# Altium schematic sheet Sheet1.SchDoc
size A4; SheetNumber: 1; SheetTotal: 1
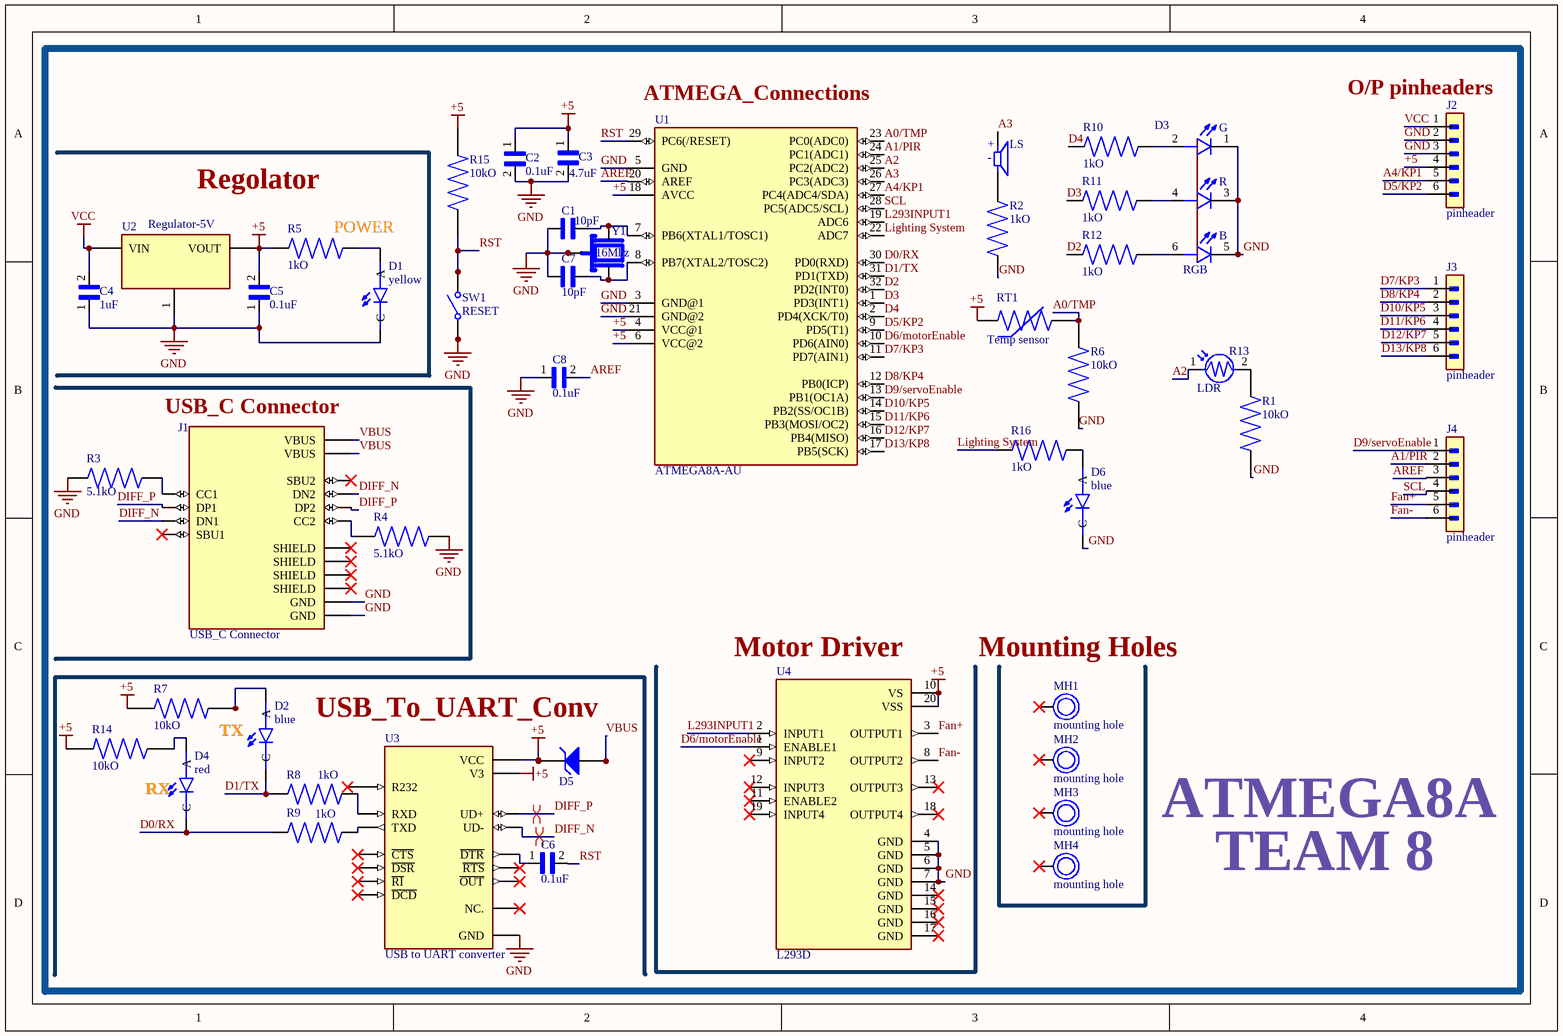
[diagram p0: Sheet1.SchDoc]

## Parts
C1  10pF  [Cap10pF]
C2  0.1uF  [Cap0.1uF]
C3  4.7uF  [Cap4.7uF]
C4  1uF  [Cap 1uF]
C5  0.1uF  [Cap0.1uF]
C6  0.1uF  [Cap0.1uF]
C7  10pF  [Cap10pF]
C8  0.1uF  [Cap0.1uF]
D1  yellow  [yellow LED]
D2  blue  [red LED]
D3  RGB  [RGB LED]
D4  red  [red LED]
D5  Zener  [Zener 5.6V]  (value not drawn)
D6  blue  [red LED]
J1  USB_C Connector  [TYPE-C-31-M-12]
J2  pinheader  [pinheader 6 pins]
J3  pinheader  [pinheader 6 pins]
J4  pinheader  [pinheader 6 pins]
LS  Buzzer  [Buzzers]  (value not drawn)
MH1  mounting hole  [Mounting Hole]  (no BOM)
MH2  mounting hole  [Mounting Hole]  (no BOM)
MH3  mounting hole  [Mounting Hole]  (no BOM)
MH4  mounting hole  [Mounting Hole]  (no BOM)
R1  10kO  [Res10k]
R2  1kO  [Res1k]
R3  5.1kO  [Res5.1kO]
R4  5.1kO  [Res5.1kO]
R5  1kO  [Res1k]
R6  10kO  [Res10k]
R7  10kO  [Res10k]
R8  1kO  [Res1k]
R9  1kO  [Res1k]
R10  1kO  [Res1k]
R11  1kO  [Res1k]
R12  1kO  [Res1k]
R13  LDR  [LDR sensor]
R14  10kO  [Res10k]
R15  10kO  [Res10k]
R16  1kO  [Res1k]
RT1  Temp sensor  [Temp sensor]
SW1  RESET  [Pushbutton Switch]
U1  ATMEGA8A-AU  [ATMEGA8A-AU]
U2  Regulator-5V  [Regulator-5V]
U3  USB to UART converter  [USB to UART converter]
U4  L293D  [L293D]
Y1  16Mhz  [Crystal16Mhz]

## Nets
+5: C2.1 C3.1 C5.2 D5.1(K) J2.4 R5.1 R7.1 R14.1 R15.2 RT1.1 U1.4(VCC@1) U1.6(VCC@2) U1.18(AVCC) U2.2(VOUT) U3.4(V3) U3.16(VCC) U4.10(VS) U4.20(VSS)
GND: C1.1 C2.2 C3.2 C4.1 C5.1 C7.1 C8.1 D1.C D3.1(G_C) D3.3(R_C) D3.5(B_C) D6.C J1.A1_B12(GND) J1.B1_A12(GND) J2.2 J2.3 R1.1 R2.2 R3.1 R4.2 R6.1 SW1.1(COM) SW1.2(COM) U1.3(GND@1) U1.5(GND) U1.21(GND@2) U2.1(GND/ADJ) U3.1(GND) U4.4(GND) U4.5(GND) U4.6(GND) U4.7(GND) Y1.2(GND) Y1.4(GND)
VCC: C4.2 J2.1 U2.3(VIN)
A0/TMP: R6.2 RT1.2 U1.23(PC0(ADC0))
A1/PIR: J4.2 U1.24(PC1(ADC1))
A2: R13.1 U1.25(PC2(ADC2))
A3: LS.1(P) U1.26(PC3(ADC3))
A4/KP1: J2.5 U1.27(PC4(ADC4/SDA))
AREF: C8.2 J4.3 U1.20(AREF)
D0/RX: D4.C R9.1 U1.30(PD0(RXD))
D1/TX: D2.C R8.1 U1.31(PD1(TXD))
D2: R12.1 U1.32(PD2(INT0))
D3: R11.1 U1.1(PD3(INT1))
D4: R10.1 U1.2(PD4(XCK/T0))
D5/KP2: J2.6 U1.9(PD5(T1))
D6/motorEnable: U1.10(PD6(AIN0)) U4.1(ENABLE1)
D7/KP3: J3.1 U1.11(PD7(AIN1))
D8/KP4: J3.2 U1.12(PB0(ICP))
D9/servoEnable: J4.1 U1.13(PB1(OC1A))
D10/KP5: J3.3 U1.14(PB2(SS/OC1B))
D11/KP6: J3.4 U1.15(PB3(MOSI/OC2))
D12/KP7: J3.5 U1.16(PB4(MISO))
D13/KP8: J3.6 U1.17(PB5(SCK))
DIFF_N: J1.A7(DN1) J1.B7(DN2) U3.6(UD-)
DIFF_P: J1.A6(DP1) J1.B6(DP2) U3.5(UD+)
Fan+: J4.5 U4.3(OUTPUT1)
Fan-: J4.6 U4.8(OUTPUT2)
L293INPUT1: U1.19(ADC6) U4.2(INPUT1)
Lighting System: R16.1 U1.22(ADC7)
RST: C6.2 R15.1 SW1.3(NO) SW1.4(NO) U1.29(PC6(/RESET))
SCL: J4.4 U1.28(PC5(ADC5/SCL))
VBUS: D5.2(A) J1.A4_B9(VBUS) J1.B4_A9(VBUS)
NetC1_2: C1.2 U1.7(PB6(XTAL1/TOSC1)) Y1.1
NetC6_1: C6.1 U3.13(~{DTR})
NetC7_2: C7.2 U1.8(PB7(XTAL2/TOSC2)) Y1.3
NetD1_A: D1.A R5.2
NetD2_A: D2.A R7.2
NetD3_2: D3.2(G_A) R10.2
NetD3_4: D3.4(R_A) R11.2
NetD3_6: D3.6(B_A) R12.2
NetD4_A: D4.A R14.2
NetD6_A: D6.A R16.2
NetJ1_A5: J1.A5(CC1) R3.2
NetJ1_B5: J1.B5(CC2) R4.1
NetLS_2: LS.2(N) R2.1
NetR1_2: R1.2 R13.2
NetR8_2: R8.2 U3.3(RXD)
NetR9_2: R9.2 U3.2(TXD)

Not connected (* = marked no-connect by the designer): J1 A8(SBU1)* B8(SBU2)* S1(SHIELD)* S2(SHIELD)* S3(SHIELD)* S4(SHIELD)*; MH1 1*; MH2 1*; MH3 1*; MH4 1*; U3 7(NC.)* 8(~{OUT})* 9(~{CTS})* 10(~{DSR})* 11(~{RI})* 12(~{DCD})* 14(~{RTS})* 15(R232)*; U4 9(INPUT2)* 11(ENABLE2)* 12(INPUT3)* 13(OUTPUT3)* 14(GND)* 15(GND)* 16(GND)* 17(GND)* 18(OUTPUT4)* 19(INPUT4)*

## Layout directives
differential pair: DIFF_N, DIFF_P

## Notes on the sheet
- (near U1) ATMEGA_Connections
- (near J2) O/P pinheaders
- Regolator
- (near R5) POWER
- (near J1) USB_C Connector
- USB_To_UART_Conv
- (near U4) Motor Driver
- (near MH1) Mounting Holes
- TX
- RX
- ATMEGA8A
- TEAM 8
- (in symbol Buzzers) +; -
- (in symbol RGB LED) G; R; B

## Library data of the parts
C1 C7 = Cap10pF: 16V 10pF null ±5% 01005 Multilayer Ceramic Capacitors MLCC - SMD/SMT ROHS; Manufacrurar: Murata Electronics; Manufacturer Part Number: GRM0225C1C100JA03L; Supplier: LCSC; Supplier Part Number: C710762
C2 C5 C6 C8 = Cap 0.1uF: 50V 100nF X7R ±10% 0402 Multilayer Ceramic Capacitors MLCC - SMD/SMT ROHS; Manufacrurar: Murata Electronics; Manufacturer Part Number: GRM155R71H104KE14D; Supplier: LCSC; Supplier Part Number: C77020
C3 = Cap 4.7uF: 10V 4.7uF X5R ±20% 0402 Multilayer Ceramic Capacitors MLCC - SMD/SMT ROHS; Manufacrurar: Murata Electronics; Manufacturer Part Number: GRM155R61A475MEAAD; Supplier: LCSC; Supplier Part Number: C335105
C4 = Cap 1uF: 10V 1uF X5R ±20% 0201 Multilayer Ceramic Capacitors MLCC - SMD/SMT ROHS; Manufacrurar: Murata Electronics; Manufacturer Part Number: GRM033R61A105ME44D; Supplier: LCSC; Supplier Part Number: C76935
D1 = yellow LED: 20mA 6mcd Colorless transparent lens -55℃~+85℃ 569nm Yellow Green 130° 100mW 2.1V 0603 LED Indication - Discrete ROHS; Manufacrurar: Lite-On; Manufacturer Part Number: LTST-C190GKT; Supplier: LCSC; Supplier Part Number: C125093
D2 D6 = blue LED: 20mA 104mcd Colorless transparent lens -20℃~+80℃ 465nm~475nm Blue 130° 76mW 3.3V 0805 LED Indication - Discrete ROHS; Manufacrurar: Lite-On; Manufacturer Part Number: LTST-C170TBKT; Supplier: LCSC; Supplier Part Number: C98222
D3 = RGB LED: 0606 RGB LEDs ROHS; Manufacrurar: Everlight Elec; Manufacturer Part Number: 19-337C/RSBHGHC-A88/4T; Supplier: LCSC; Supplier Part Number: C3019536
D4 = red LED: 20mA 99mcd Colorless transparent lens -30℃~+85℃ 631nm Red 130° 62.5mW 2V 0603 LED Indication - Discrete ROHS; Manufacrurar: Lite-On; Manufacturer Part Number: LTST-C190KRKT; Supplier: LCSC; Supplier Part Number: C94869
D5 = Zener 5.6V: Independent Type 5.2V~6V 500mW 5.6V SOD-123 Zener Diodes ROHS; Manufacturer: Diodes Incorporated; Manufacturer Part Number: BZT52C5V6-7-F; Supplier: LCSC; Supplier Part Number: C397930
J1 = TYPE-C-31-M-12: 5A 1 16P Female Type-C SMD USB Connectors ROHS; Manufacturer: Korean Hroparts Elec; Manufacturar Part Number: TYPE-C-31-M-12; Supplier: LCSC; Supplier Part Number: C165948
J2-J4 = pinheader 6 pins: 3A Direct Insert Policy 2.54mm 6P 5.84mm -65℃~+125℃ 3.05mm 2.54mm Single Row Phosphor Bronze Black Plugin,P=2.54mm Pin Headers ROHS; Manufacrurar: Amphenol ICC; Manufacturer Part Number: 68001-106HLF; Supplier: LCSC; Supplier Part Number: C3330006
LS = Buzzers: 65dB Passive (external drive) Piezoelectric 4kHz Buzzers ROHS; Manufacrurar: Murata Electronics; Manufacturer Part Number: PKMCS0909E4000-R1; Supplier: LCSC; Supplier Part Number: C910763
MH1-MH4 = mounting hole: mounting hole 3.2mm inner diameter and 5.6mm outer
R1 R6 R7 R14 R15 = Res 10k: 100mW Thick Film Resistors ±100ppm/℃ ±1% 10kΩ 0603 Chip Resistor - Surface Mount ROHS; Manufacrurar: PANASONIC; Manufacturer Part Number: ERJ3EKF1002V; Supplier: LCSC; Supplier Part Number: C191124
R2 R5 R8-R12 R16 = Res 1k: 100mW Thick Film Resistors ±100ppm/℃ ±1% 1kΩ 0402 Chip Resistor - Surface Mount ROHS; Manufacrurar: PANASONIC; Manufacturer Part Number: ERJ2RKF1001X; Supplier: LCSC; Supplier Part Number: C191124
R3 R4 = Res5.1kO: 100mW Thick Film Resistors ±5% ±200ppm/℃ 5.1kΩ 0402 Chip Resistor - Surface Mount ROHS; Manufacrurar: PANASONIC; Manufacturer Part Number: ERJ2GEJ512X; Supplier: LCSC; Supplier Part Number: C413002
R13 = LDR sensor: SMD,2.4x3.6mm Photoresistors ROHS; Manufacrurar: JCHL(Shenzhen Jing Chuang He Li Tech); Manufacturer Part Number: GT36528; Supplier: LCSC; Supplier Part Number: C2904881
RT1 = Temp sensor: 100kΩ 32uA ±0.5% 4250K ±0.5% 0402 NTC Thermistors ROHS; Manufacrurar: Murata Electronics; Manufacturer Part Number: NCU15WF104D60RC; Supplier: LCSC; Supplier Part Number: C426654
SW1 = Pushbutton Switch: 6mm 5mm Round Button 50mA Standing paste 6mm SPST 24V SMD Tactile Switches ROHS; Manufacrurar: TE Connectivity; Manufacturer Part Number: 4-1437565-2; Supplier: LCSC; Supplier Part Number: C86487
U1 = ATMEGA8A-AU: 8KB 1KB FLASH 23 2.7V~5.5V AVR 16MHz TQFP-32(7x7) Microcontrollers (MCU/MPU/SOC) ROHS; Manufacrurar: Microchip Tech; Manufacturer Part Number: ATMEGA8A-AU; Supplier: LCSC; Supplier Part Number: C16190
U2 = Regulator-5V: 1A 60dB@(120Hz) Fixed 5V Positive electrode 12V SOT-223 Voltage Regulators - Linear, Low Drop Out (LDO) Regulators ROHS; Manufacrurar: UMW(Youtai Semiconductor Co., Ltd.); Manufacturer Part Number: AMS1117-5.0; Supplier: LCSC; Supplier Part Number: C347223
U3 = USB to UART converter: 2Mbps Transceiver USB 2.0 SOP-16 USB Converters ROHS; Manufacrurar: WCH(Jiangsu Qin Heng); Manufacturer Part Number: CH340C; Supplier: LCSC; Supplier Part Number: C84681
U4 = L293D: SOIC-20-300mil Stepper Motor Driver ROHS; Manufacrurar: STMicroelectronics; Manufacturer Part Number: L293DD013TR; Supplier: LCSC; Supplier Part Number: C21610
Y1 = Crystal16Mhz: 1.8V~3.3V ±10ppm ±20ppm CMOS 16MHz SMD3225-4P Crystal Oscillators ROHS; Manufacrurar: YXC Crystal Oscillators; Manufacturer Part Number: OT2EL4C4JI-111OLP-16M; Supplier: LCSC; Supplier Part Number: C5189452